# EAGLE schematic CM_Prototype (EAGLE 9.6.2)
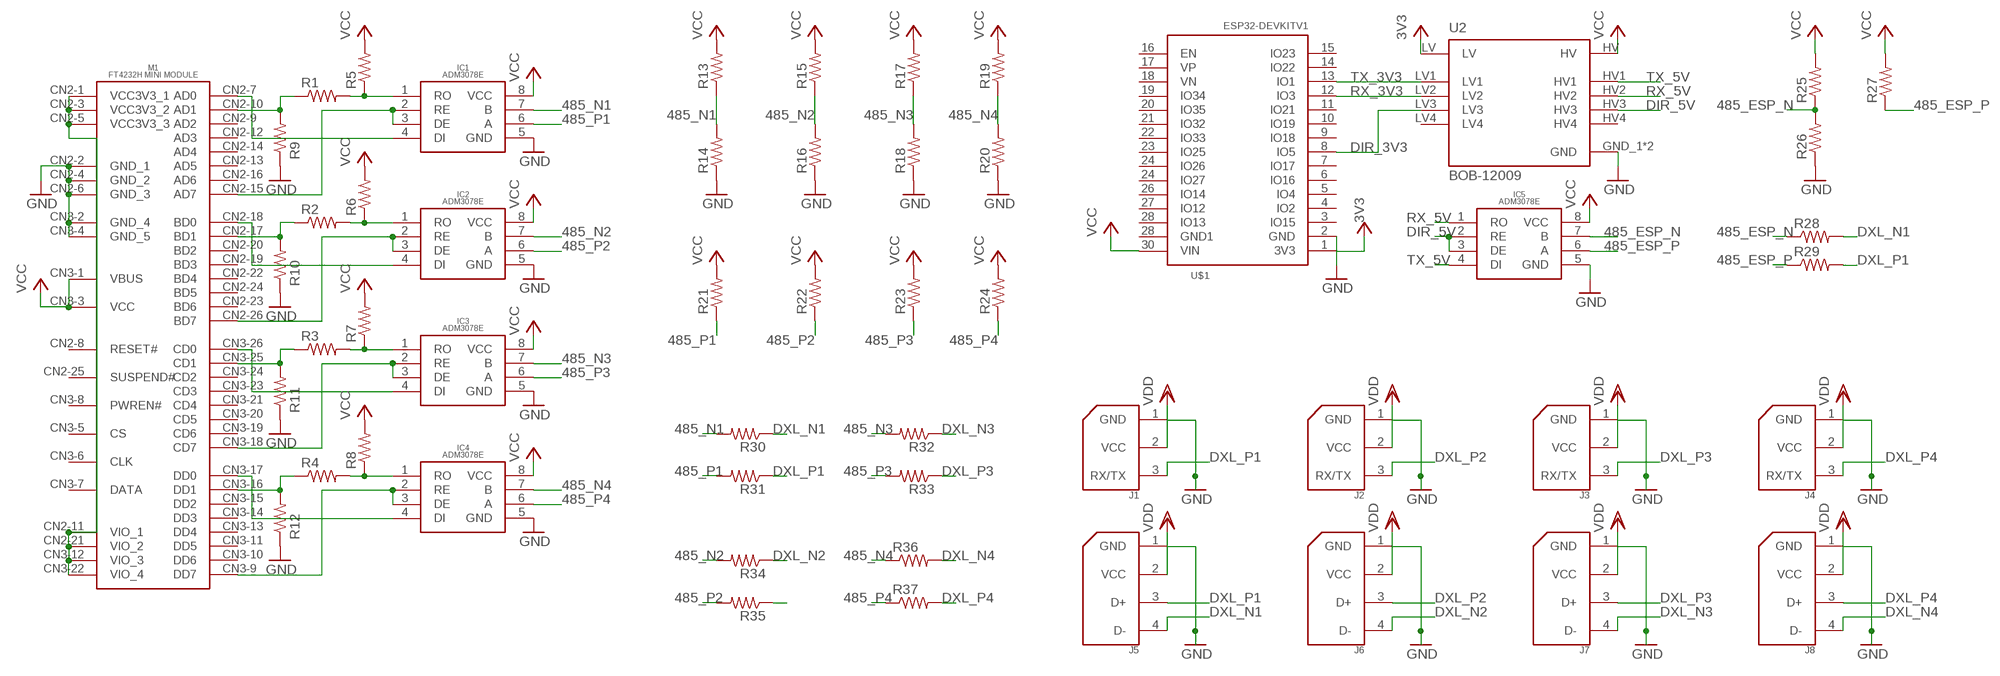
[diagram p0: schematic, sheet 1]

## Parts
IC1  ADM3078E  [ADM3078E]
IC2  ADM3078E  [ADM3078E]
IC3  ADM3078E  [ADM3078E]
IC4  ADM3078E  [ADM3078E]
IC5  ADM3078E  [ADM3078E]
J1  22-03-5035  [5267-3]
J2  22-03-5035  [5267-3]
J3  22-03-5035  [5267-3]
J4  22-03-5035  [5267-3]
J5  22-03-5045  [5267-4]
J6  22-03-5045  [5267-4]
J7  22-03-5045  [5267-4]
J8  22-03-5045  [5267-4]
M1  FT4232H_MINI_MODULE  [FT4232H_MINI_MODULE]
R1  R_1206  [1206]
R2  R_1206  [1206]
R3  R_1206  [1206]
R4  R_1206  [1206]
R5  R_0805  [0805]
R6  R_0805  [0805]
R7  R_0805  [0805]
R8  R_0805  [0805]
R9  R_0805  [0805]
R10  R_0805  [0805]
R11  R_0805  [0805]
R12  R_0805  [0805]
R13  R_0805  [0805]
R14  R_0805  [0805]
R15  R_0805  [0805]
R16  R_0805  [0805]
R17  R_0805  [0805]
R18  R_0805  [0805]
R19  R_0805  [0805]
R20  R_0805  [0805]
R21  R_0805  [0805]
R22  R_0805  [0805]
R23  R_0805  [0805]
R24  R_0805  [0805]
R25  R_0805  [0805]
R26  R_0805  [0805]
R27  R_0805  [0805]
R28  R_1206  [1206]
R29  R_1206  [1206]
R30  R_1206  [1206]
R31  R_1206  [1206]
R32  R_1206  [1206]
R33  R_1206  [1206]
R34  R_1206  [1206]
R35  R_1206  [1206]
R36  R_1206  [1206]
R37  R_1206  [1206]
U2  BOB-12009  [CONV_BOB-12009]
U$1  ESP32DEVKITV1  [ESP32-DEVKITV1]

## Nets
3V3: U2.LV U$1.1(3V3) ; supply symbol labelled VCC
485_ESP_N: IC5.7(B) R25.1 R26.2 R28.1
485_ESP_P: IC5.6(A) R27.1 R29.1
485_N1: IC1.7(B) R13.1 R14.2 R30.2
485_N2: IC2.7(B) R15.1 R16.2 R34.2
485_N3: IC3.7(B) R17.1 R18.2 R32.2
485_N4: IC4.7(B) R19.1 R20.2 R36.1
485_P1: IC1.6(A) R21.1 R31.2
485_P2: IC2.6(A) R22.1 R35.2
485_P3: IC3.6(A) R23.1 R33.2
485_P4: IC4.6(A) R24.1 R37.1
DIR_3V3: U2.LV3 U$1.8(IO5)
DIR_5V: IC5.2(RE) IC5.3(DE) U2.HV3
DXL_N1: J5.4(D-) R28.2 R30.1
DXL_N2: J6.4(D-) R34.1
DXL_N3: J7.4(D-) R32.1
DXL_N4: J8.4(D-) R36.2
DXL_P1: J1.3(RX/TX) J5.3(D+) R29.2 R31.1
DXL_P2: J2.3(RX/TX) J6.3(D+) R35.1
DXL_P3: J3.3(RX/TX) J7.3(D+) R33.1
DXL_P4: J4.3(RX/TX) J8.3(D+) R37.2
GND: IC1.5(GND) IC2.5(GND) IC3.5(GND) IC4.5(GND) IC5.5(GND) J1.1(GND) J2.1(GND) J3.1(GND) J4.1(GND) J5.1(GND) J6.1(GND) J7.1(GND) J8.1(GND) M1.CN2-2(GND_1) M1.CN2-4(GND_2) M1.CN2-6(GND_3) M1.CN3-2(GND_4) M1.CN3-4(GND_5) R9.1 R10.1 R11.1 R12.1 R14.1 R16.1 R18.1 R20.1 R26.1 U2.GND_1(GND) U2.GND_2(GND) U$1.2(GND)
N$1: IC1.2(RE) IC1.3(DE) M1.CN2-15(AD7)
N$2: IC2.2(RE) IC2.3(DE) M1.CN2-26(BD7)
N$3: IC3.2(RE) IC3.3(DE) M1.CN3-18(CD7)
N$4: IC4.2(RE) IC4.3(DE) M1.CN3-9(DD7)
N$5: M1.CN2-10(AD1) R1.1 R9.2
N$6: IC1.1(RO) R1.2 R5.1
N$7: M1.CN2-17(BD1) R2.1 R10.2
N$8: IC2.1(RO) R2.2 R6.1
N$9: IC3.1(RO) R3.2 R7.1
N$10: M1.CN3-25(CD1) R3.1 R11.2
N$11: M1.CN3-16(DD1) R4.1 R12.2
N$12: IC4.1(RO) R4.2 R8.1
N$13: IC1.4(DI) M1.CN2-7(AD0)
N$14: IC2.4(DI) M1.CN2-18(BD0)
N$15: IC3.4(DI) M1.CN3-26(CD0)
N$16: IC4.4(DI) M1.CN3-17(DD0)
N$21: M1.CN2-1(VCC3V3_1) M1.CN2-3(VCC3V3_2) M1.CN2-5(VCC3V3_3) M1.CN2-11(VIO_1) M1.CN2-21(VIO_2) M1.CN3-12(VIO_3) M1.CN3-22(VIO_4)
RX_3V3: U2.LV2 U$1.12(IO3)
RX_5V: IC5.1(RO) U2.HV2
TX_3V3: U2.LV1 U$1.13(IO1)
TX_5V: IC5.4(DI) U2.HV1
VCC: IC1.8(VCC) IC2.8(VCC) IC3.8(VCC) IC4.8(VCC) IC5.8(VCC) M1.CN3-1(VBUS) M1.CN3-3(VCC) R5.2 R6.2 R7.2 R8.2 R13.2 R15.2 R17.2 R19.2 R21.2 R22.2 R23.2 R24.2 R25.2 R27.2 U2.HV U$1.30(VIN)
VDD: J1.2(VCC) J2.2(VCC) J3.2(VCC) J4.2(VCC) J5.2(VCC) J6.2(VCC) J7.2(VCC) J8.2(VCC)
Unconnected: M1.CN2-8(RESET#) M1.CN2-9(AD2) M1.CN2-12(AD3) M1.CN2-13(AD5) M1.CN2-14(AD4) M1.CN2-16(AD6) M1.CN2-19(BD3) M1.CN2-20(BD2) M1.CN2-22(BD4) M1.CN2-23(BD6) M1.CN2-24(BD5) M1.CN2-25(SUSPEND#) M1.CN3-5(CS) M1.CN3-6(CLK) M1.CN3-7(DATA) M1.CN3-8(PWREN#) M1.CN3-10(DD6) M1.CN3-11(DD5) M1.CN3-13(DD4) M1.CN3-14(DD3) M1.CN3-15(DD2) M1.CN3-19(CD6) M1.CN3-20(CD5) M1.CN3-21(CD4) M1.CN3-23(CD3) M1.CN3-24(CD2) U2.HV4 U2.LV4 U$1.3(IO15) U$1.4(IO2) U$1.5(IO4) U$1.6(IO16) U$1.7(IO17) U$1.9(IO18) U$1.10(IO19) U$1.11(IO21) U$1.14(IO22) U$1.15(IO23) U$1.16(EN) U$1.17(VP) U$1.18(VN) U$1.19(IO34) U$1.20(IO35) U$1.21(IO32) U$1.22(IO33) U$1.23(IO25) U$1.24(IO26) U$1.24(IO27) U$1.26(IO14) U$1.27(IO12) U$1.28(GND1) U$1.28(IO13)

## Library data of the parts
IC1-IC5 = ADM3078E:ADM3078E
J1-J4 = molex:22-03-5035: Molex SPOX Vert, Tin (Dynamixel AX/MX Bus) tested: YES (arbotix)
J5-J8 = molex:22-03-5045: Molex SPOX Vert, Tin (Dynamixel RX Bus) tested: YES (arbotix2)
M1 = FT4232H_MINI_MODULE:FT4232H_MINI_MODULE
R1-R37 = RHD2000_eval_board:R: Resistor
U2 = BOB-12009:BOB-12009: Logic Level Converter - Bi-Direc Check availability <https://pricing.snapeda.com/parts/BOB-12009/SparkFun/view-part?ref=eda>; AVAILABILITY: In Stock; DESCRIPTION: BSS138 Logic-Level Translator Interface Evaluation Board; MF: SparkFun; MP: BOB-12009; PACKAGE: None; PRICE: None; PURCHASE-URL: https://pricing.snapeda.com/search/part/BOB-12009/?ref=eda
U$1 = ESP32-DEVKITV1:ESP32DEVKITV1